# Altium project Fomu-Programmer.PrjPcb
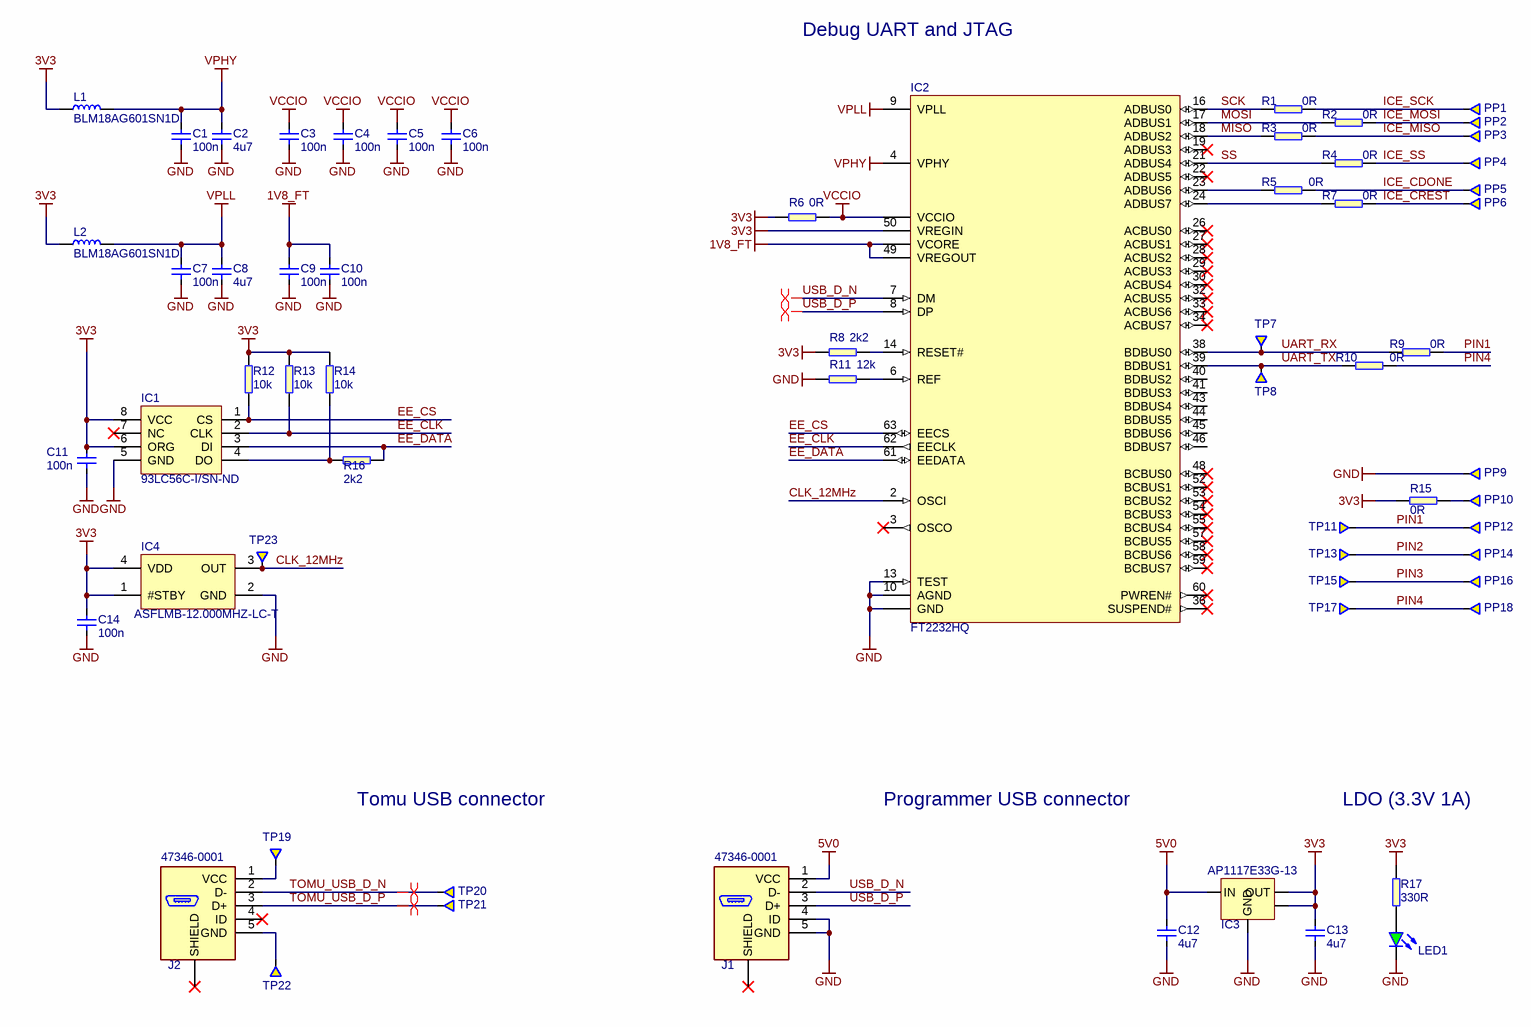
[diagram p0: Programmer.SchDoc]
AM_Author: Antmicro; AM_Revision: 1.1; AM_Status: Prototype; AM_Title: Fomu programmer
2 sheets, 80 parts. Net scope: global (net labels, ports and power ports of the same name join across sheets).
Board file: PCB.PcbDoc
Sheets:
  Programmer.SchDoc
  Mechanics.SchDoc

## Sheet Programmer.SchDoc
size A3; SheetNumber: 1; SheetTotal: 1; PageSetup: Record=PageOptions|CenterHorizontal=True|CenterVertical=True|PrintScale=0.97|XCorrection=1.00|YCorrection=1.00|PrintKind=1|BorderSize=5000000|LeftOffset=0|BottomOffset=0|Orientation=2|PaperLength=2970|PaperWidth=2100|Scale=100|PaperSource=7|PrintQuality=600|MediaType=1|DitherType=10|PaperKind=A4|PrintScaleMode=1

### Parts
C1  100n  [0402]
C2  4u7  [0402]
C3  100n  [0402]
C4  100n  [0402]
C5  100n  [0402]
C6  100n  [0402]
C7  100n  [0402]
C8  4u7  [0402]
C9  100n  [0402]
C10  100n  [0402]
C11  100n  [0402]
C12  4u7  [0402]
C13  4u7  [0402]
C14  100n  [0402]
IC1  93LC56C-I/SN-ND  [SOIC-8]
IC2  FT2232HQ  [FT2232HQ]
IC3  AP1117E33G-13  [SOT223]
IC4  ASFLMB-12.000MHZ-LC-T  [ASFLMB]
J1  PartSymbol: 47346-0001  [CON-Molex-047346-0001]  (hidden comment: Molex 47346-0001)
J2  PartSymbol: 47346-0001  [CON-Molex-047346-0001]  (hidden comment: Molex 47346-0001)
L1  BLM18AG601SN1D  [0603]
L2  BLM18AG601SN1D  [0603]
LED1  KPT-1608SGC  [LED0603]  (value not drawn)
PP1  (no value)  [TP-R-1.5-THT]
PP2  (no value)  [TP-R-1.5-THT]
PP3  (no value)  [TP-R-1.5-THT]
PP4  (no value)  [TP-R-1.5-THT]
PP5  (no value)  [TP-R-1.5-THT]
PP6  (no value)  [TP-R-1.5-THT]
PP9  (no value)  [TP-R-1.5-THT]
PP10  (no value)  [TP-R-1.5-THT]
PP12  (no value)  [TP-R-1.5-THT]
PP14  (no value)  [TP-R-1.5-THT]
PP16  (no value)  [TP-R-1.5-THT]
PP18  (no value)  [TP-R-1.5-THT]
R1  0R  [0402]
R2  0R  [0402]
R3  0R  [0402]
R4  0R  [0402]
R5  0R  [0402]
R6  0R  [0402]
R7  0R  [0402]
R8  2k2  [0402]
R9  0R  [0402]
R10  0R  [0402]
R11  12k  [0402]
R12  10k  [0402]
R13  10k  [0402]
R14  10k  [0402]
R15  0R  [0402]
R16  2k2  [0402]
R17  330R  [0402]
TP7  Testpad  [TP-R-1.5]  (value not drawn)  (no BOM)
TP8  Testpad  [TP-R-1.5]  (value not drawn)  (no BOM)
TP11  Testpad  [TP-R-1.5]  (value not drawn)  (no BOM)
TP13  Testpad  [TP-R-1.5]  (value not drawn)  (no BOM)
TP15  Testpad  [TP-R-1.5]  (value not drawn)  (no BOM)
TP17  Testpad  [TP-R-1.5]  (value not drawn)  (no BOM)
TP19  Testpad  [TP-R-1.5]  (value not drawn)  (no BOM)
TP20  Testpad  [TP-R-1.5]  (value not drawn)  (no BOM)
TP21  Testpad  [TP-R-1.5]  (value not drawn)  (no BOM)
TP22  Testpad  [TP-R-1.5]  (value not drawn)  (no BOM)
TP23  Testpad  [TP-R-1.5]  (value not drawn)  (no BOM)

### Nets
1V8_FT: C9.2 C10.2 IC2.49(VREGOUT) IC2.VCORE
3V3: C11.2 C13.2 C14.2 IC1.6(ORG) IC1.8(VCC) IC2.50(VREGIN) IC3.2(OUT) IC3.4(OUT) IC4.1(#STBY) IC4.4(VDD) L1.1 L2.1 R6.1 R8.1 R12.2 R13.2 R14.2 R15.1 R17.2
5V0: C12.2 IC3.3(IN) J1.1(VCC)
GND: C1.1 C2.1 C3.1 C4.1 C5.1 C6.1 C7.1 C8.1 C9.1 C10.1 C11.1 C12.1 C13.1 C14.1 IC1.5(GND) IC2.10(AGND) IC2.13(TEST) IC2.GND IC3.1(GND) IC4.2(GND) J1.4(ID) J1.5(GND) LED1.K PP9.1 R11.1
VCCIO: C3.2 C4.2 C5.2 C6.2 IC2.VCCIO R6.2
VPHY: C1.2 C2.2 IC2.4(VPHY) L1.2
VPLL: C7.2 C8.2 IC2.9(VPLL) L2.2
CLK_12MHz: IC2.2(OSCI) IC4.3(OUT) TP23.1
EE_CLK: IC1.2(CLK) IC2.62(EECLK) R13.1
EE_CS: IC1.1(CS) IC2.63(EECS) R12.1
EE_DATA: IC1.3(DI) IC2.61(EEDATA) R16.2
ICE_CDONE: PP5.1 R5.2
ICE_CREST: PP6.1 R7.2
ICE_MISO: PP3.1 R3.2
ICE_MOSI: PP2.1 R2.2
ICE_SCK: PP1.1 R1.2
ICE_SS: PP4.1 R4.2
MISO: IC2.18(ADBUS2) R3.1
MOSI: IC2.17(ADBUS1) R2.1
PIN1: PP12.1 R9.2 TP11.1
PIN2: PP14.1 TP13.1
PIN3: PP16.1 TP15.1
PIN4: PP18.1 R10.2 TP17.1
SCK: IC2.16(ADBUS0) R1.1
SS: IC2.21(ADBUS4) R4.1
TOMU_USB_D_N: J2.2(D-) TP20.1
TOMU_USB_D_P: J2.3(D+) TP21.1
UART_RX: IC2.38(BDBUS0) R9.1 TP7.1
UART_TX: IC2.39(BDBUS1) R10.1 TP8.1
USB_D_N: IC2.7(DM) J1.2(D-)
USB_D_P: IC2.8(DP) J1.3(D+)
NetIC1_4: IC1.4(DO) R14.1 R16.1
NetIC2_6: IC2.6(REF) R11.2
NetIC2_14: IC2.14(RESET#) R8.2
NetIC2_23: IC2.23(ADBUS6) R5.1
NetIC2_24: IC2.24(ADBUS7) R7.1
NetJ2_1: J2.1(VCC) TP19.1
NetJ2_5: J2.5(GND) TP22.1
NetLED1_A: LED1.A R17.1
NetPP10_1: PP10.1 R15.2

Not connected (* = marked no-connect by the designer): IC1 7(NC)*; IC2 3(OSCO)* 19(ADBUS3)* 22(ADBUS5)* 26(ACBUS0)* 27(ACBUS1)* 28(ACBUS2)* 29(ACBUS3)* 30(ACBUS4)* 32(ACBUS5)* 33(ACBUS6)* 34(ACBUS7)* 36(SUSPEND#)* 40(BDBUS2) 41(BDBUS3) 43(BDBUS4) 44(BDBUS5) 45(BDBUS6) 46(BDBUS7) 48(BCBUS0)* 52(BCBUS1)* 53(BCBUS2)* 54(BCBUS3)* 55(BCBUS4)* 57(BCBUS5)* 58(BCBUS6)* 59(BCBUS7)* 60(PWREN#)*; J1 S(SHIELD)*; J2 4(ID)* S(SHIELD)*

### Layout directives
differential pair: TOMU_USB_D_N, TOMU_USB_D_P, USB_D_N, USB_D_P

### Notes on the sheet
- Debug UART and JTAG
- (near TP19) Tomu USB connector
- Programmer USB connector
- LDO (3.3V 1A)
- Title:
- Size:
- Date:
- A3
- Revision:
- Page:
- of
- Antmicro Ltd.
- File:
- www.antmicro.com

### Library data of the parts
C1 C3-C7 C9-C11 C14 = C_100n_0402: MLCC SMT Capacitor 100nF 0402; Manufacturer: AVX; PartSymbol: 0402YC104KAT2A; PartNumber: C_100n_0402; Value: 100n
C2 C8 C12 C13 = C_4u7_0402: MLCC SMT Capacitor 100nF 0402; Manufacturer: TDK; PartSymbol: C1005X5R0J475M050BC; PartNumber: C_4u7_0402; Value: 4u7
IC1 = 93LC56C: EEPROM SERIAL 1K, SMD, 93C46, SOIC8; Manufacturer: Microchip Technology; PartNumber: 93LC56C; Value: 93LC56C-I/SN-ND; PartSymbol: 93LC56C-I/SN-ND
IC2 = FT2232HL: Dual USB-UART/FIFO; Manufacturer: FTDI; Value: FT2232HQ; PartSymbol: FT2232HQ; PartNumber: FT2232HQ
IC3 = xx1117: IC, LDO, REG, 3.3V, SOT223; Manufacturer: DIODES INC.; PartNumber: AP1117E33G-13; PartSymbol: AP1117E33G-13; Value: AP1117E33G-13
IC4 = ASFLMB: MEMS Oscillator, Ultra-miniature, 12 MHz, SMD, 5mm x 3.2mm, 50 ppm, 3.3 V; Manufacturer: Abracon LLC; PartNumber: ASFLMB-12.000MHZ-LC-T; Value: ASFLMB-12.000MHZ-LC-T; PartSymbol: ASFLMB-12.000MHZ-LC-T
J1 J2 = Micro USB B: USB - micro B Receptacle Connector 5 Position Surface Mount, Right Angle, Horizontal; PartNumber: CON-Molex-47346-0001; Value: Molex 47346-0001; Manufacturer: Molex
L1 L2 = Inductor SMT: Ferrite Bead, 600 ohm, 0603 [1608 Metric], BLM18A Series, 500 mA, 0.38 ohm, ? 25%; Manufacturer: MURATA; PartNumber: BLM18AG601SN1D; Value: BLM18AG601SN1D; PartSymbol: BLM18AG601SN1D
LED1 = LED: LED Green 0603 case; PartNumber: LED_G; Manufacturer: KINGBRIGHT; Value: KPT-1608SGC; PartSymbol: KPT-1608SGC
PP1-PP6 PP9 PP10 PP12 PP14 PP16 PP18 = Testpad_pin: Testpad, round, 1.8mm; PartNumber: P70-2300045R; Manufacturer: Harwin; PartSymbol: P70-2300045R
R1-R7 R9 R10 R15 = R_0R_0402: SMT Resistor 0402; Manufacturer: Vishay; PartSymbol: CRCW04020000Z0ED; PartNumber: R_0R_0402; Value: 0R
R8 R16 = R_2k2_0402: SMT Resistor 0402; Manufacturer: Vishay; PartSymbol: CRCW04022K20FKED; PartNumber: R_2k2_0402; Value: 2k2
R11 = R_12k_0402: SMT Resistor 0402; Manufacturer: Multicomp; PartSymbol: MCWR04X1202FTL; PartNumber: R_12k_0402; Value: 12k
R12-R14 = R_10k_0402: SMT Resistor 0402; Manufacturer: Vishay; PartSymbol: CRCW040210K0FKED; PartNumber: R_10k_0402; Value: 10k
R17 = R_330R_0402: SMT Resistor 0402; Manufacturer: Multicomp; PartSymbol: MCMR04X3300FTL; PartNumber: R_330R_0402; Value: 330R
TP7 TP8 TP11 TP13 TP15 TP17 TP19-TP23 = Testpad: Testpad, round, 1.5mm; PartNumber: TP-R-1.5

## Sheet Mechanics.SchDoc
size A3; SheetNumber: 1; SheetTotal: 1; PageSetup: Record=PageOptions|CenterHorizontal=True|CenterVertical=True|PrintScale=0.97|XCorrection=1.00|YCorrection=1.00|PrintKind=1|BorderSize=5000000|LeftOffset=0|BottomOffset=0|Orientation=2|PaperLength=2970|PaperWidth=2100|Scale=100|PaperSource=7|PrintQuality=600|MediaType=1|DitherType=10|PaperKind=A4|PrintScaleMode=1
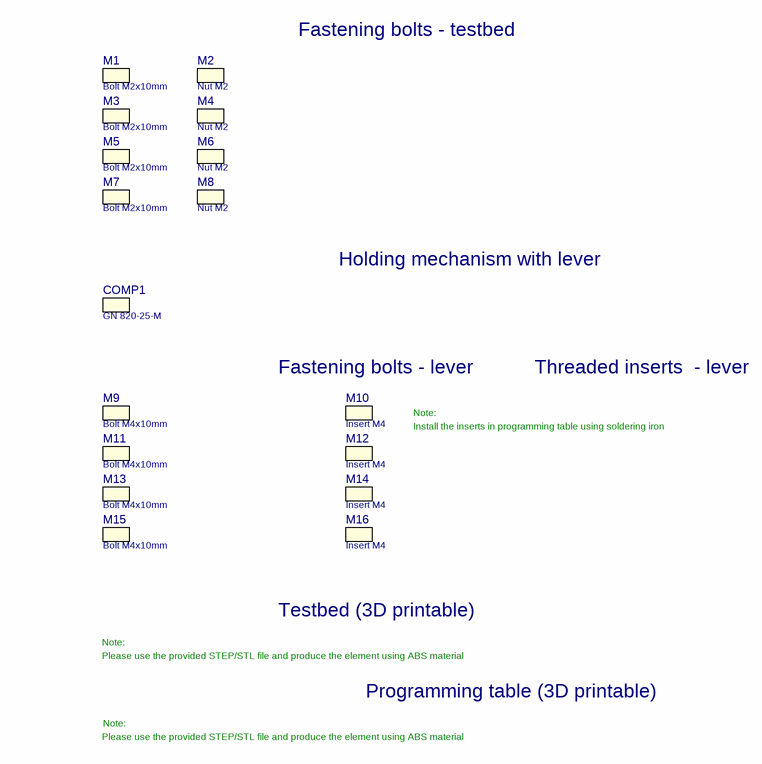
[diagram p1: Mechanics.SchDoc]

### Parts
COMP1  GN 820-25-M  (mechanical)
M1  Bolt M2x10mm  (mechanical)
M2  Nut M2  (mechanical)
M3  Bolt M2x10mm  (mechanical)
M4  Nut M2  (mechanical)
M5  Bolt M2x10mm  (mechanical)
M6  Nut M2  (mechanical)
M7  Bolt M2x10mm  (mechanical)
M8  Nut M2  (mechanical)
M9  Bolt M4x10mm  (mechanical)
M10  Insert M4  (mechanical)
M11  Bolt M4x10mm  (mechanical)
M12  Insert M4  (mechanical)
M13  Bolt M4x10mm  (mechanical)
M14  Insert M4  (mechanical)
M15  Bolt M4x10mm  (mechanical)
M16  Insert M4  (mechanical)

### Notes on the sheet
- Fastening bolts - testbed
- Holding mechanism with lever
- Fastening bolts - lever
- Install the inserts in programming table using soldering iron
- Note:
- (near M10) Threaded inserts  - lever
- Testbed (3D printable)
- Please use the provided STEP/STL file and produce the element using ABS material
- Programming table (3D printable)
- Title:
- Size:
- Date:
- A3
- Revision:
- Page:
- of
- Antmicro Ltd.
- File:
- www.antmicro.com

### Library data of the parts
COMP1 = GENERIC_BOM_ONLY: Manufacturer: ELESA+GANTER; PartNumber: GN 820-25-M; PartSymbol: GN 820-25-M; Value: GN 820-25-M
M1 M3 M5 M7 = GENERIC_BOM_ONLY: Bolt M4x10mm; Manufacturer: BOSSARD; PartNumber: M2X10/BN1435; Value: Bolt M2x10mm; PartSymbol: Bolt M2x10mm
M2 M4 M6 M8 = GENERIC_BOM_ONLY: Bolt M4x10mm; Manufacturer: BOSSARD; PartNumber: M2/BN109; Value: Nut M2; PartSymbol: Nut M2
M9 M11 M13 M15 = GENERIC_BOM_ONLY: Manufacturer: BOSSARD; PartNumber: M4X10/BN1435 SN213306; Value: Bolt M4x10mm; PartSymbol: Bolt M4x10mm
M10 M12 M14 M16 = GENERIC_BOM_ONLY: Bolt M4x10mm; Manufacturer: BOSSARD; PartNumber: M4/BN1052; Value: Insert M4; PartSymbol: Insert M4

## Assembly variants
Prototype: all parts fitted